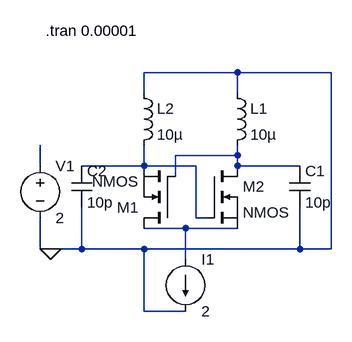
[diagram p0: schematic Draft2.asc]
Draft2.asc, the LTspice schematic file:
Version 4
SHEET 1 880 680
WIRE 544 128 400 128
WIRE 688 128 544 128
WIRE 400 160 400 128
WIRE 544 160 544 128
WIRE 544 256 544 240
WIRE 544 256 448 256
WIRE 240 272 240 240
WIRE 400 272 400 240
WIRE 400 272 304 272
WIRE 480 272 400 272
WIRE 544 272 544 256
WIRE 640 272 544 272
WIRE 448 288 448 256
WIRE 480 352 480 272
WIRE 496 352 480 352
WIRE 464 368 400 368
WIRE 544 368 464 368
WIRE 240 400 240 352
WIRE 256 400 240 400
WIRE 304 400 304 336
WIRE 304 400 256 400
WIRE 400 400 304 400
WIRE 640 400 640 336
WIRE 640 400 400 400
WIRE 688 400 688 128
WIRE 688 400 640 400
WIRE 464 416 464 368
WIRE 400 496 400 400
WIRE 464 496 400 496
FLAG 256 400 0
SYMBOL voltage 240 256 R0
SYMATTR InstName V1
SYMATTR Value 2
SYMBOL ind 528 144 R0
SYMATTR InstName L1
SYMATTR Value 10µ
SYMBOL ind 384 144 R0
SYMATTR InstName L2
SYMATTR Value 10µ
SYMBOL nmos 448 368 R180
SYMATTR InstName M1
SYMBOL nmos 496 272 R0
SYMATTR InstName M2
SYMBOL cap 624 272 R0
SYMATTR InstName C1
SYMATTR Value 10p
SYMBOL cap 288 272 R0
SYMATTR InstName C2
SYMATTR Value 10p
SYMBOL current 464 416 R0
SYMATTR InstName I1
SYMATTR Value 2
TEXT 248 64 Left 2 !.tran 0.00001

The netlist it stands for:
* Draft2.asc
V1 N002 0 2
L1 0 N001 10µ
L2 0 N003 10µ
M1 N004 N001 N003 N003 NMOS
M2 N001 N003 N004 N004 NMOS
C1 N001 0 10p
C2 N003 0 10p
I1 N004 0 2
.model NMOS NMOS
.model PMOS PMOS
.lib standard.mos
.tran 0.00001
.backanno
.end